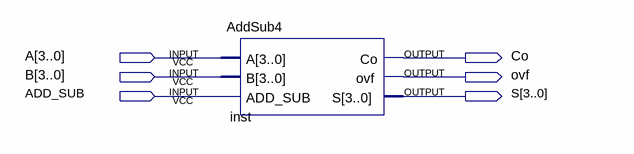
[diagram p0: schematic sheet]
// Quartus schematic AddSubDemo.bdf as structural Verilog: 1 symbols, 6 pins
module AddSubDemo (
  input  [3:0] A,
  input  [3:0] B,
  input  ADD_SUB,
  output Co,
  output ovf,
  output [3:0] S
);

  AddSub4 inst (.A(A), .B(B), .ADD_SUB(ADD_SUB), .Co(Co), .ovf(ovf), .S(S));
endmodule
